# EAGLE design CI-test-shield (EAGLE 7.1.0)
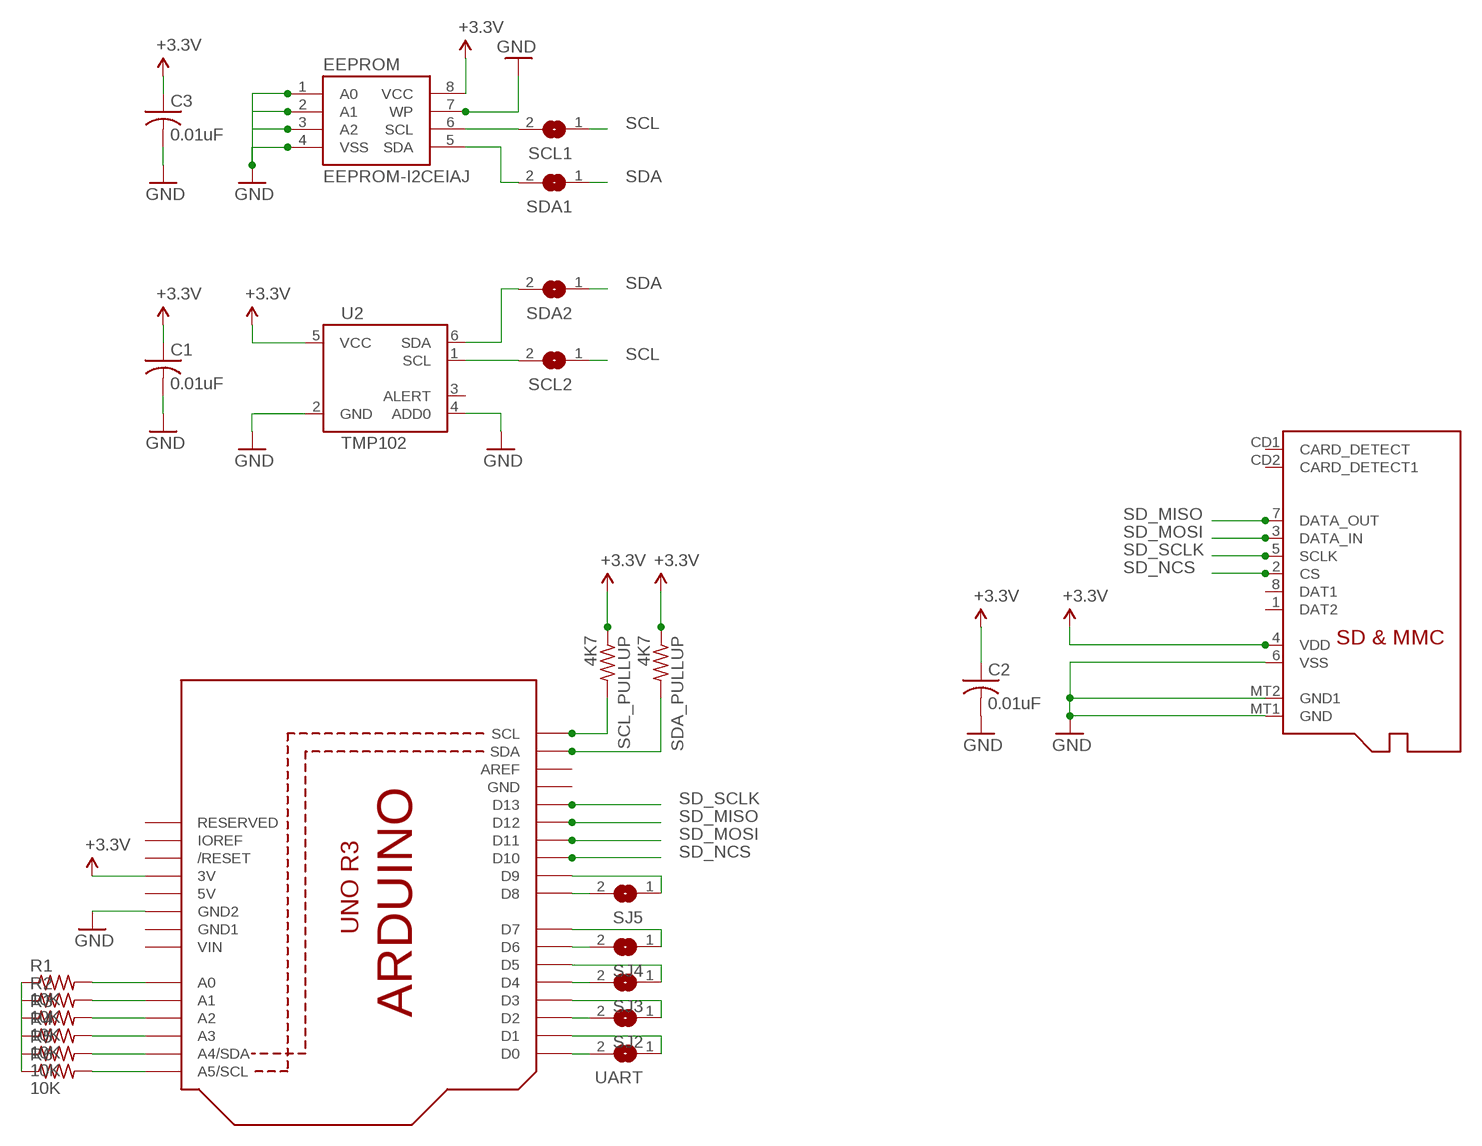
[diagram p0: schematic, sheet 1]

## Parts
C1  0.01uF  C-US025-025X050  [C025-025X050]
C2  0.01uF  C-US025-025X050  [C025-025X050]
C3  0.01uF  C-US025-025X050  [C025-025X050]
EEPROM  EEPROM-I2CEIAJ  [SO08-EIAJ]
MICRO-SD  MICROSD  [MICROSD]
R1  10K  R-US_0204/7  [0204/7]
R2  10K  R-US_0204/7  [0204/7]
R3  10K  R-US_0204/7  [0204/7]
R4  10K  R-US_0204/7  [0204/7]
R5  10K  R-US_0204/7  [0204/7]
R6  10K  R-US_0204/7  [0204/7]
SCL1  SJ  [SJ]
SCL2  SJ  [SJ]
SCL_PULLUP  4K7  R-US_0204/7  [0204/7]
SDA1  SJ  [SJ]
SDA2  SJ  [SJ]
SDA_PULLUP  4K7  R-US_0204/7  [0204/7]
SJ2  SJ  [SJ]
SJ3  SJ  [SJ]
SJ4  SJ  [SJ]
SJ5  SJ  [SJ]
U1  ARDUINOR3-BPLACE  [ARDUINOR3-BPLACE]
U2  TMP102  [SOT563]
UART  SJ  [SJ]

## Nets
+3.3V: C1.1 C2.1 C3.1 EEPROM.8(VCC) MICRO-SD.4(VDD) SCL_PULLUP.1 SDA_PULLUP.1 U1.3V U2.5(VCC)
GND: C1.2 C2.2 C3.2 EEPROM.1(A0) EEPROM.2(A1) EEPROM.3(A2) EEPROM.4(VSS) EEPROM.7(WP) MICRO-SD.6(VSS) MICRO-SD.MT1(GND) MICRO-SD.MT2(GND1) U1.GND2 U2.2(GND) U2.4(ADD0)
N$1: R1.1 R2.1 R3.1 R4.1 R5.1 R6.1
N$2: R1.2 U1.A0
N$3: R2.2 U1.A1
N$4: R3.2 U1.A2
N$5: R4.2 U1.A3
N$6: R5.2 U1.A4(A4/SDA)
N$7: R6.2 U1.A5(A5/SCL)
N$8: U1.D0 UART.2
N$9: U1.D1 UART.1
N$10: SJ2.2 U1.D2
N$11: SJ2.1 U1.D3
N$12: SJ3.2 U1.D4
N$13: SJ3.1 U1.D5
N$14: SJ4.2 U1.D6
N$15: SJ4.1 U1.D7
N$16: SJ5.2 U1.D8
N$17: SJ5.1 U1.D9
N$20: SDA2.2 U2.6(SDA)
N$21: SCL2.2 U2.1(SCL)
N$22: EEPROM.6(SCL) SCL1.2
N$23: EEPROM.5(SDA) SDA1.2
SCL: SCL1.1 SCL2.1 SCL_PULLUP.2 U1.SCL
SD_MISO: MICRO-SD.7(DATA_OUT) U1.D12
SD_MOSI: MICRO-SD.3(DATA_IN) U1.D11
SD_NCS: MICRO-SD.2(CS) U1.D10
SD_SCLK: MICRO-SD.5(SCLK) U1.D13
SDA: SDA1.1 SDA2.1 SDA_PULLUP.2 U1.SDA
Unconnected: MICRO-SD.1(DAT2) MICRO-SD.8(DAT1) MICRO-SD.CD1(CARD_DETECT) MICRO-SD.CD2(CARD_DETECT1) U1.AREF U1.IOREF U1.RESERVED U1.RESET(/RESET) U2.3(ALERT)

## Power pins joined to a net without a drawn wire
5V: U1.5V
GND: U1.GND U1.GND1
VIN: U1.VIN

## Library data of the parts
C1-C3 = adafruit:C-US: CAPACITOR, American symbol
EEPROM = SparkFun-DigitalIC:EEPROM-I2C: I2C EEPROM chips, 24LC256 (and others)
MICRO-SD = adafruit:MICROSD: Micro-SD / Transflash card holder with SPI pinout For the 3M # 2908-05WB-MG and/or 4UCON #19656 push-push type
R1-R6 SCL_PULLUP SDA_PULLUP = adafruit:R-US_: RESISTOR, American symbol
SCL1 SCL2 SDA1 SDA2 SJ2-SJ5 UART = jumper:SJ: SMD solder JUMPER
U1 = adafruit:ARDUINOR3: This is a new object for the new Arduino R3 - with extra pins that you may want to use (such as IOref, and duplicated A4/A5
U2 = SparkFun-Sensors:TMP102: I2C degC temp sensor; PROD_ID: IC-09303

## Board
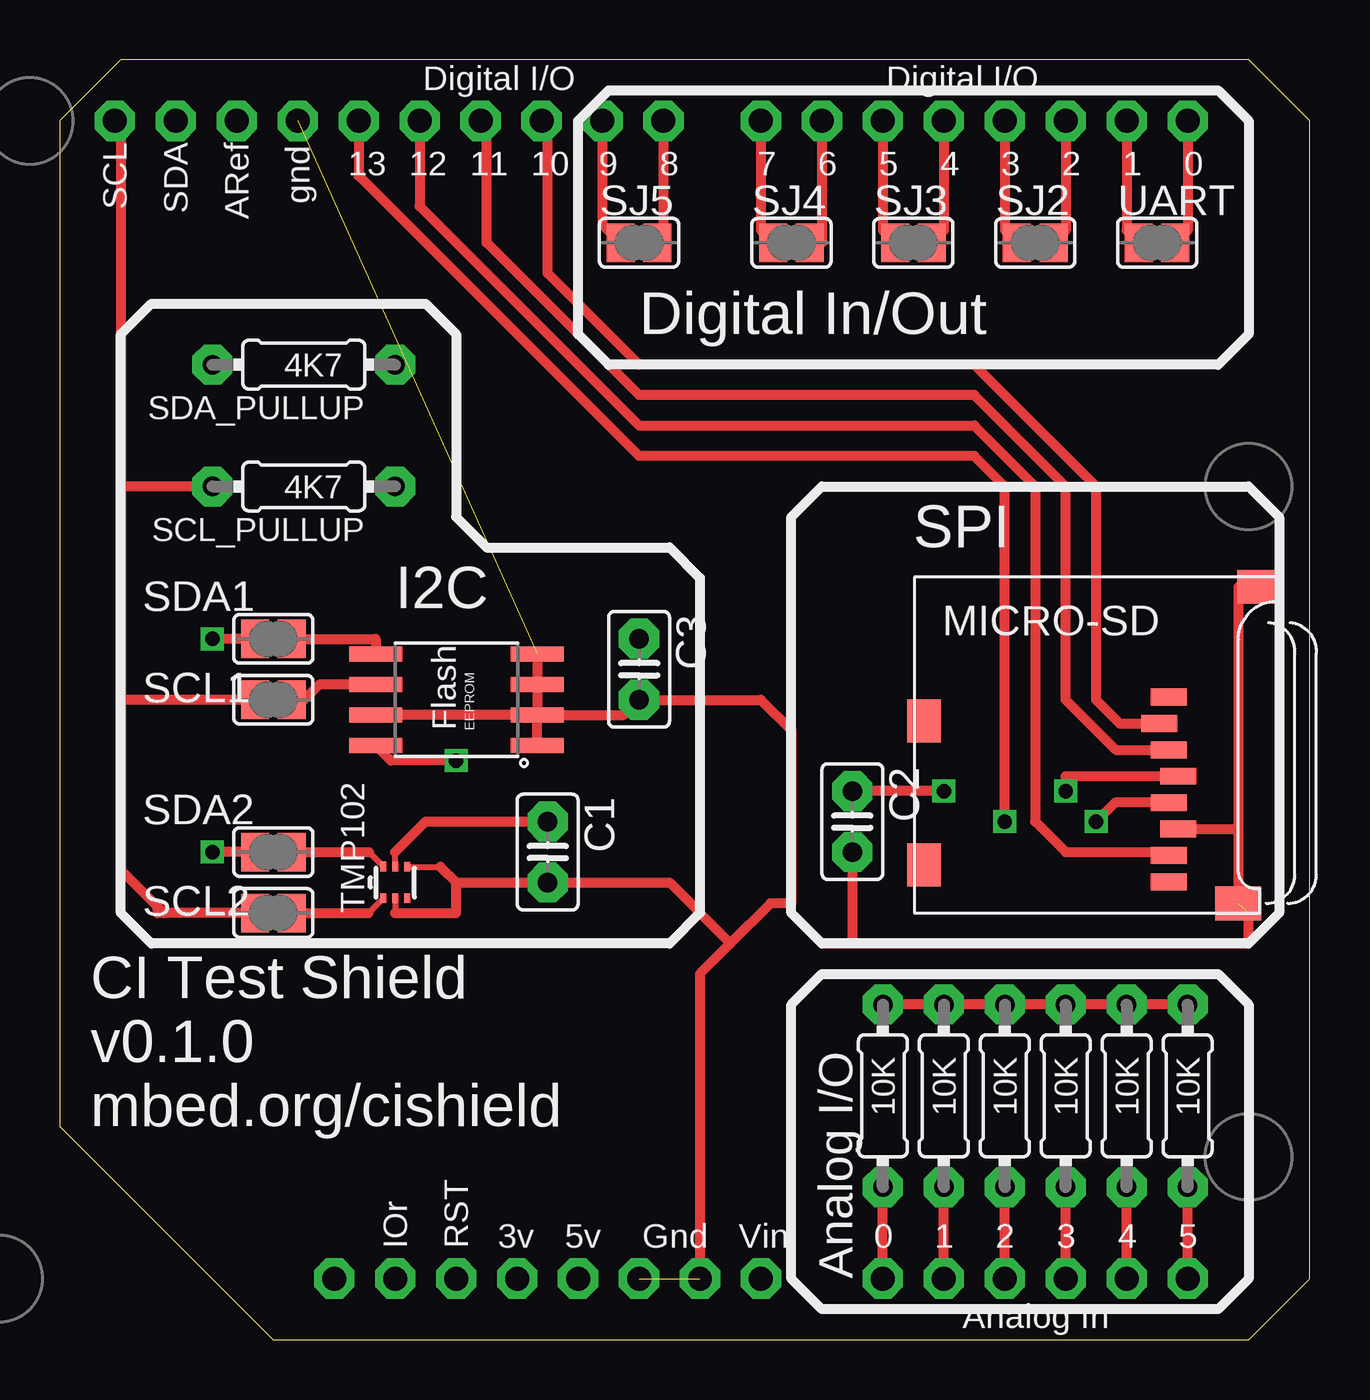
[diagram p1: board, top side]
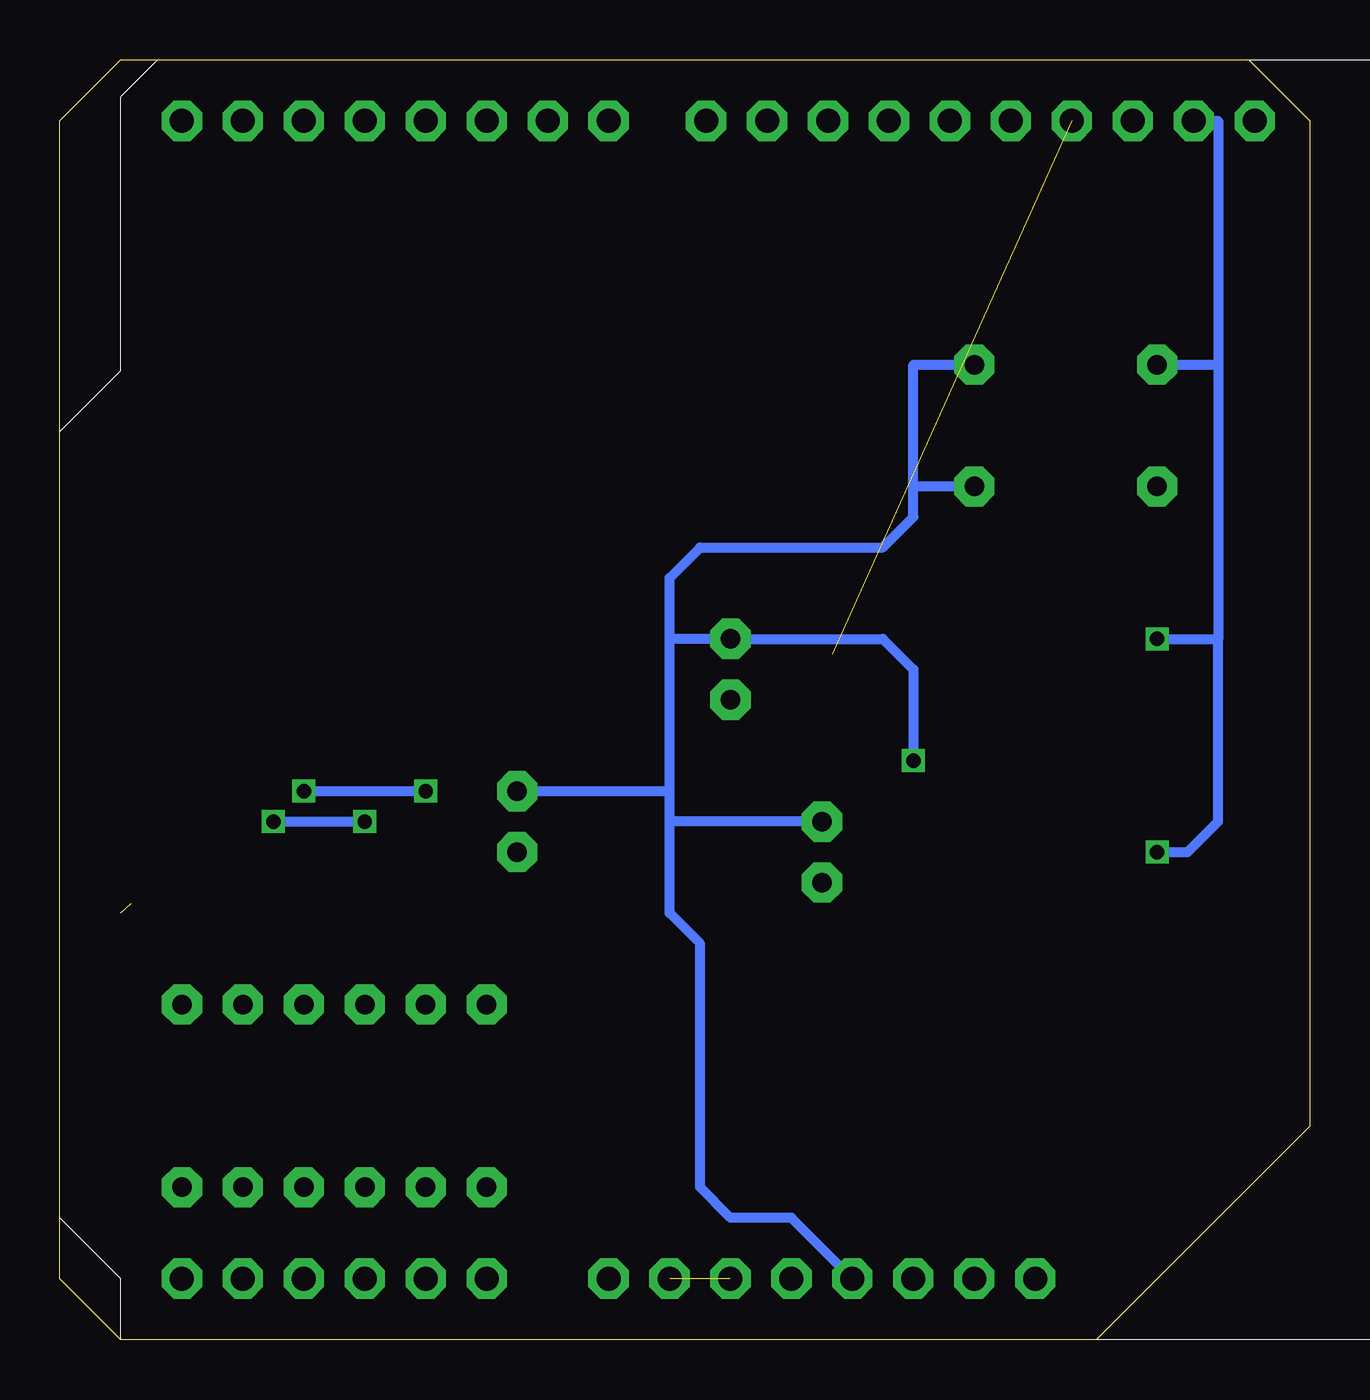
[diagram p2: board, bottom side, seen from below]

Size 52.07 x 53.34 mm. Coordinates in mm from the lower left corner, seen from the top.
Outline: 0,8.89 8.89,0 49.53,0 52.07,2.54 52.07,50.8 49.53,53.34 2.54,53.34 0,50.8 0,8.89
Copper layers (1*16): Top 0.0356mm / dielectric 1.5011mm / Bottom 0.0356mm
Design rules "LaenPCBOrder": minimum track width 6mil, minimum drill 13mil, track to track 6mil, track to pad 6mil, pad to pad 6mil, via to via 6mil, smd to smd 6mil, copper to edge 15mil, drill to drill 6mil, minimum pad ring 7mil, minimum via ring 7mil, stop-mask expansion 3mil, vias tented up to drill 0mil, thermal gap 10mil

### Footprints (pad centres in the part's own frame; a part is rotated, then mirrored left to right if it is on the bottom)
C025-025X050 = drill 0.813 pad 1.676 octagon: 1 -1.27,0; 2 1.27,0
SO08-EIAJ = smd 0.61 x 2.21: 1 -1.905,-3.378; 2 -0.635,-3.378; 3 0.635,-3.378; 4 1.905,-3.378; 5 1.905,3.353; 6 0.635,3.353; 7 -0.635,3.353; 8 -1.905,3.353
MICROSD = smd 0.7 x 1.5: 1 9,-10.64; 2 7.9,-10.24; 3 6.8,-10.64; 4 5.7,-11.04; 5 4.6,-10.64; 6 3.5,-11.04; 7 2.4,-10.64; 8 1.3,-10.64 | smd 1.8 x 1.4: CD1 2,-0.44; CD2 8,-0.44 | smd 1.4 x 1.9: MT1 0.4,-13.54; MT2 13.6,-14.44
0204/7 = drill 0.813 pad 1.676 octagon: 1 -3.81,0; 2 3.81,0
SJ = smd 1.168 x 1.6: 1 -0.762,0; 2 0.762,0
ARDUINOR3-BPLACE = drill 1 pad 1.676 octagon: 3V 35.56,2.54; 5V 38.1,2.54; A0 50.8,2.54; A1 53.34,2.54; A2 55.88,2.54; A3 58.42,2.54; A4 60.96,2.54; A5 63.5,2.54; AREF 23.876,50.8; D0 63.5,50.8; D1 60.96,50.8; D2 58.42,50.8; D3 55.88,50.8; D4 53.34,50.8; D5 50.8,50.8; D6 48.26,50.8; D7 45.72,50.8; D8 41.656,50.8; D9 39.116,50.8; D10 36.576,50.8; D11 34.036,50.8; D12 31.496,50.8; D13 28.956,50.8; GND 26.416,50.8; GND1 43.18,2.54; GND2 40.64,2.54; IOREF 30.48,2.54; RESERVED 27.94,2.54; RESET 33.02,2.54; SCL 18.796,50.8; SDA 21.336,50.8; VIN 45.72,2.54
SOT563 = smd 0.25 x 0.4: 1 -0.5,-0.66; 2 0,-0.66; 3 0.5,-0.66; 4 0.5,0.66; 5 0,0.66; 6 -0.5,0.67

### Placement (x,y rotation side)
C1  20.32,20.32 270 top
C2  33.02,21.59 270 top
C3  24.13,27.94 270 top
EEPROM  16.51,26.67 90 top
MICRO-SD  35.56,17.78 90 top
R1  34.29,10.16 270 top
R2  36.83,10.16 270 top
R3  39.37,10.16 270 top
R4  41.91,10.16 270 top
R5  44.45,10.16 270 top
R6  46.99,10.16 270 top
SCL1  8.89,26.67 0 top
SCL2  8.89,17.78 0 top
SCL_PULLUP  10.16,35.56 180 top
SDA1  8.89,29.21 0 top
SDA2  8.89,20.32 0 top
SDA_PULLUP  10.16,40.64 180 top
SJ2  40.64,45.72 0 top
SJ3  35.56,45.72 0 top
SJ4  30.48,45.72 0 top
SJ5  24.13,45.72 0 top
U1  -16.51,0 0 top
U2  13.97,19.05 0 top
UART  45.72,45.72 0 top

### Tracks (layer width: path | path; a pad name or v marks a point on that pad's centre or on a via)
+3.3V  (via drill 0.6)
  Top 0.254: U2.5 13.97,20.32
  Top 0.406: MICRO-SD.4 41.91,23.48 v41.91,22.86 | v36.83,22.86 C2.1 | v16.51,24.13 13.79,24.13 EEPROM.8 | 13.97,20.32 15.24,21.59 C1.1
  Bottom 0.406: v41.91,22.86 v36.83,22.86 | U1.3V 21.59,5.08 24.13,5.08 25.4,6.35 25.4,16.51 26.67,17.78 26.67,21.59 | 26.67,21.59 26.67,22.86 | 26.67,22.86 26.67,29.21 | 26.67,29.21 26.67,31.75 25.4,33.02 17.78,33.02 16.51,34.29 16.51,35.56 | 16.51,35.56 16.51,40.64 SDA_PULLUP.1 | SCL_PULLUP.1 16.51,35.56 | C2.1 26.67,22.86 | C1.1 26.67,21.59 | v16.51,24.13 16.51,27.94 17.78,29.21 C3.1 26.67,29.21
GND  (3 unrouted)
  Top 0.254: U2.4 15.85,19.71 | U2.2 13.97,17.78
  Top 0.406: MICRO-SD.MT2 49.1,31.38 49.1,21.28 | 49.1,21.28 MICRO-SD.MT1 | MICRO-SD.6 49.1,21.28 | 30.48,18.18 29.61,18.18 27.94,16.51 | 27.94,16.51 26.67,15.24 U1.GND1 | 33.02,18.18 C2.2 33.02,16.51 | 27.94,16.51 25.4,19.05 C1.2 16.51,19.05 | 30.48,18.18 30.48,25.4 29.21,26.67 C3.2 23.49,26.04 EEPROM.2 | EEPROM.4 EEPROM.3 EEPROM.2 | EEPROM.1 EEPROM.2 | EEPROM.2 EEPROM.7 | 15.85,19.71 16.51,19.05 | 13.97,17.78 16.51,17.78 16.51,19.05 | 33.02,16.51 31.75,16.51 30.48,17.78 30.48,18.18 | 33.02,16.51 49.53,16.51 49.53,17.78
N$1
  Top 0.406: R6.1 R5.1 R4.1 R3.1 R2.1 R1.1
N$2
  Top 0.406: U1.A0 R1.2
N$3
  Top 0.406: U1.A1 R2.2
N$4
  Top 0.406: U1.A2 R3.2
N$5
  Top 0.406: U1.A3 R4.2
N$6
  Top 0.406: U1.A4 R5.2
N$7
  Top 0.406: U1.A5 R6.2
N$8
  Top 0.406: U1.D0 46.99,46.23 UART.2
N$9
  Top 0.406: U1.D1 44.45,46.23 UART.1
N$10
  Top 0.406: U1.D2 41.91,46.23 SJ2.2
N$11
  Top 0.406: U1.D3 39.37,46.23 SJ2.1
N$12
  Top 0.406: U1.D4 36.83,46.23 SJ3.2
N$13
  Top 0.406: U1.D5 34.29,46.23 SJ3.1
N$14
  Top 0.406: U1.D6 31.75,45.72 SJ4.2
N$15
  Top 0.406: U1.D7 29.21,46.23 SJ4.1
N$16
  Top 0.406: U1.D8 25.15,45.97 SJ5.2
N$17
  Top 0.406: U1.D9 22.61,46.48 SJ5.1
N$20
  Top 0.254: 12.87,20.32 U2.6
  Top 0.406: SDA2.2 12.87,20.32
N$21
  Top 0.254: 12.86,17.78 U2.1
  Top 0.406: SCL2.2 12.86,17.78
N$22
  Top 0.406: EEPROM.6 10.8,27.3 10.16,26.67 SCL1.2
N$23
  Top 0.406: SDA1.2 13.16,29.21 EEPROM.5
SCL
  Top 0.406: U1.SCL 2.54,50.8 2.54,35.56 | 2.54,35.56 2.54,26.67 | 2.54,26.67 2.54,19.58 4.07,18.04 | 4.07,18.04 4.34,17.78 | SCL_PULLUP.2 2.54,35.56 | SCL1.1 2.54,26.67 | SCL2.1 4.07,17.78 4.07,18.04
  Bottom 0.406: U1.SCL 2.54,50.8
SD_MISO
  Top 0.406: U1.D12 14.99,47.24 24.13,38.1 38.1,38.1 40.64,35.56 40.64,21.59 41.91,20.32 46.2,20.32 MICRO-SD.7
SD_MOSI
  Top 0.406: U1.D11 17.78,50.55 17.78,45.72 24.13,39.37 38.1,39.37 41.91,35.56 41.91,26.67 44,24.58 MICRO-SD.3
SD_NCS
  Top 0.406: U1.D10 20.32,50.55 20.32,44.45 24.13,40.64 38.1,40.64 43.18,35.56 43.18,26.67 44.17,25.68 MICRO-SD.2
SD_SCLK  (via drill 0.6)
  Top 0.406: U1.D13 12.45,48.51 24.13,36.83 38.1,36.83 39.37,35.56 v39.37,21.59 | v43.18,21.59 43.97,22.38 MICRO-SD.5
  Bottom 0.406: v43.18,21.59 v39.37,21.59
SDA  (via drill 0.6)
  Top 0.406: SDA1.1 v6.35,29.21 | SDA2.1 v6.35,20.32
  Bottom 0.406: U1.SDA 3.81,50.8 3.81,40.64 | 3.81,40.64 3.81,29.21 | v6.35,20.32 5.08,20.32 3.81,21.59 3.81,29.21 | SDA_PULLUP.2 3.81,40.64 | v6.35,29.21 3.81,29.21

### Text on the board
_tsilk: Digital In/Out | SPI | I2C | Flash | TMP102 | CI Test Shield / v0.1.0 / mbed.org/cishield | Analog I/O
_bsilk: Tests / Analog I/O - A0-5 mesh / Digital I/O - D0-D9 loopback / UART - D0/1 loopback / SPI - micoSD W/R / I2C - Flash / Temp Sensor / PWM - Loopback / Interrupt In - Loopback